# Altium project 2m_DBoard_TX.PrjPcb (part 2 of 2)

## Sheet Digital.SchDoc: {Наименование}
size 420 x 297 mm; DocumentNumber: ПЛАС.ХХХХХХ.ХХХ ХХ; SheetNumber: {}; SheetTotal: {}; PageSetup: Record=PageOptions|CenterHorizontal=False|CenterVertical=False|PrintScale=0.95|XCorrection=0.00|YCorrection=0.00|PrintKind=1|BorderSize=5000000|LeftOffset=0|BottomOffset=0|Orientation=1|PaperLength=1000|PaperWidth=1000|Scale=100|PaperSource=15|PrintQuality=600|MediaType=1|DitherType=10|PaperKind=A4|PrintScaleMode=1; Rule: PcbType=ProtelPcb
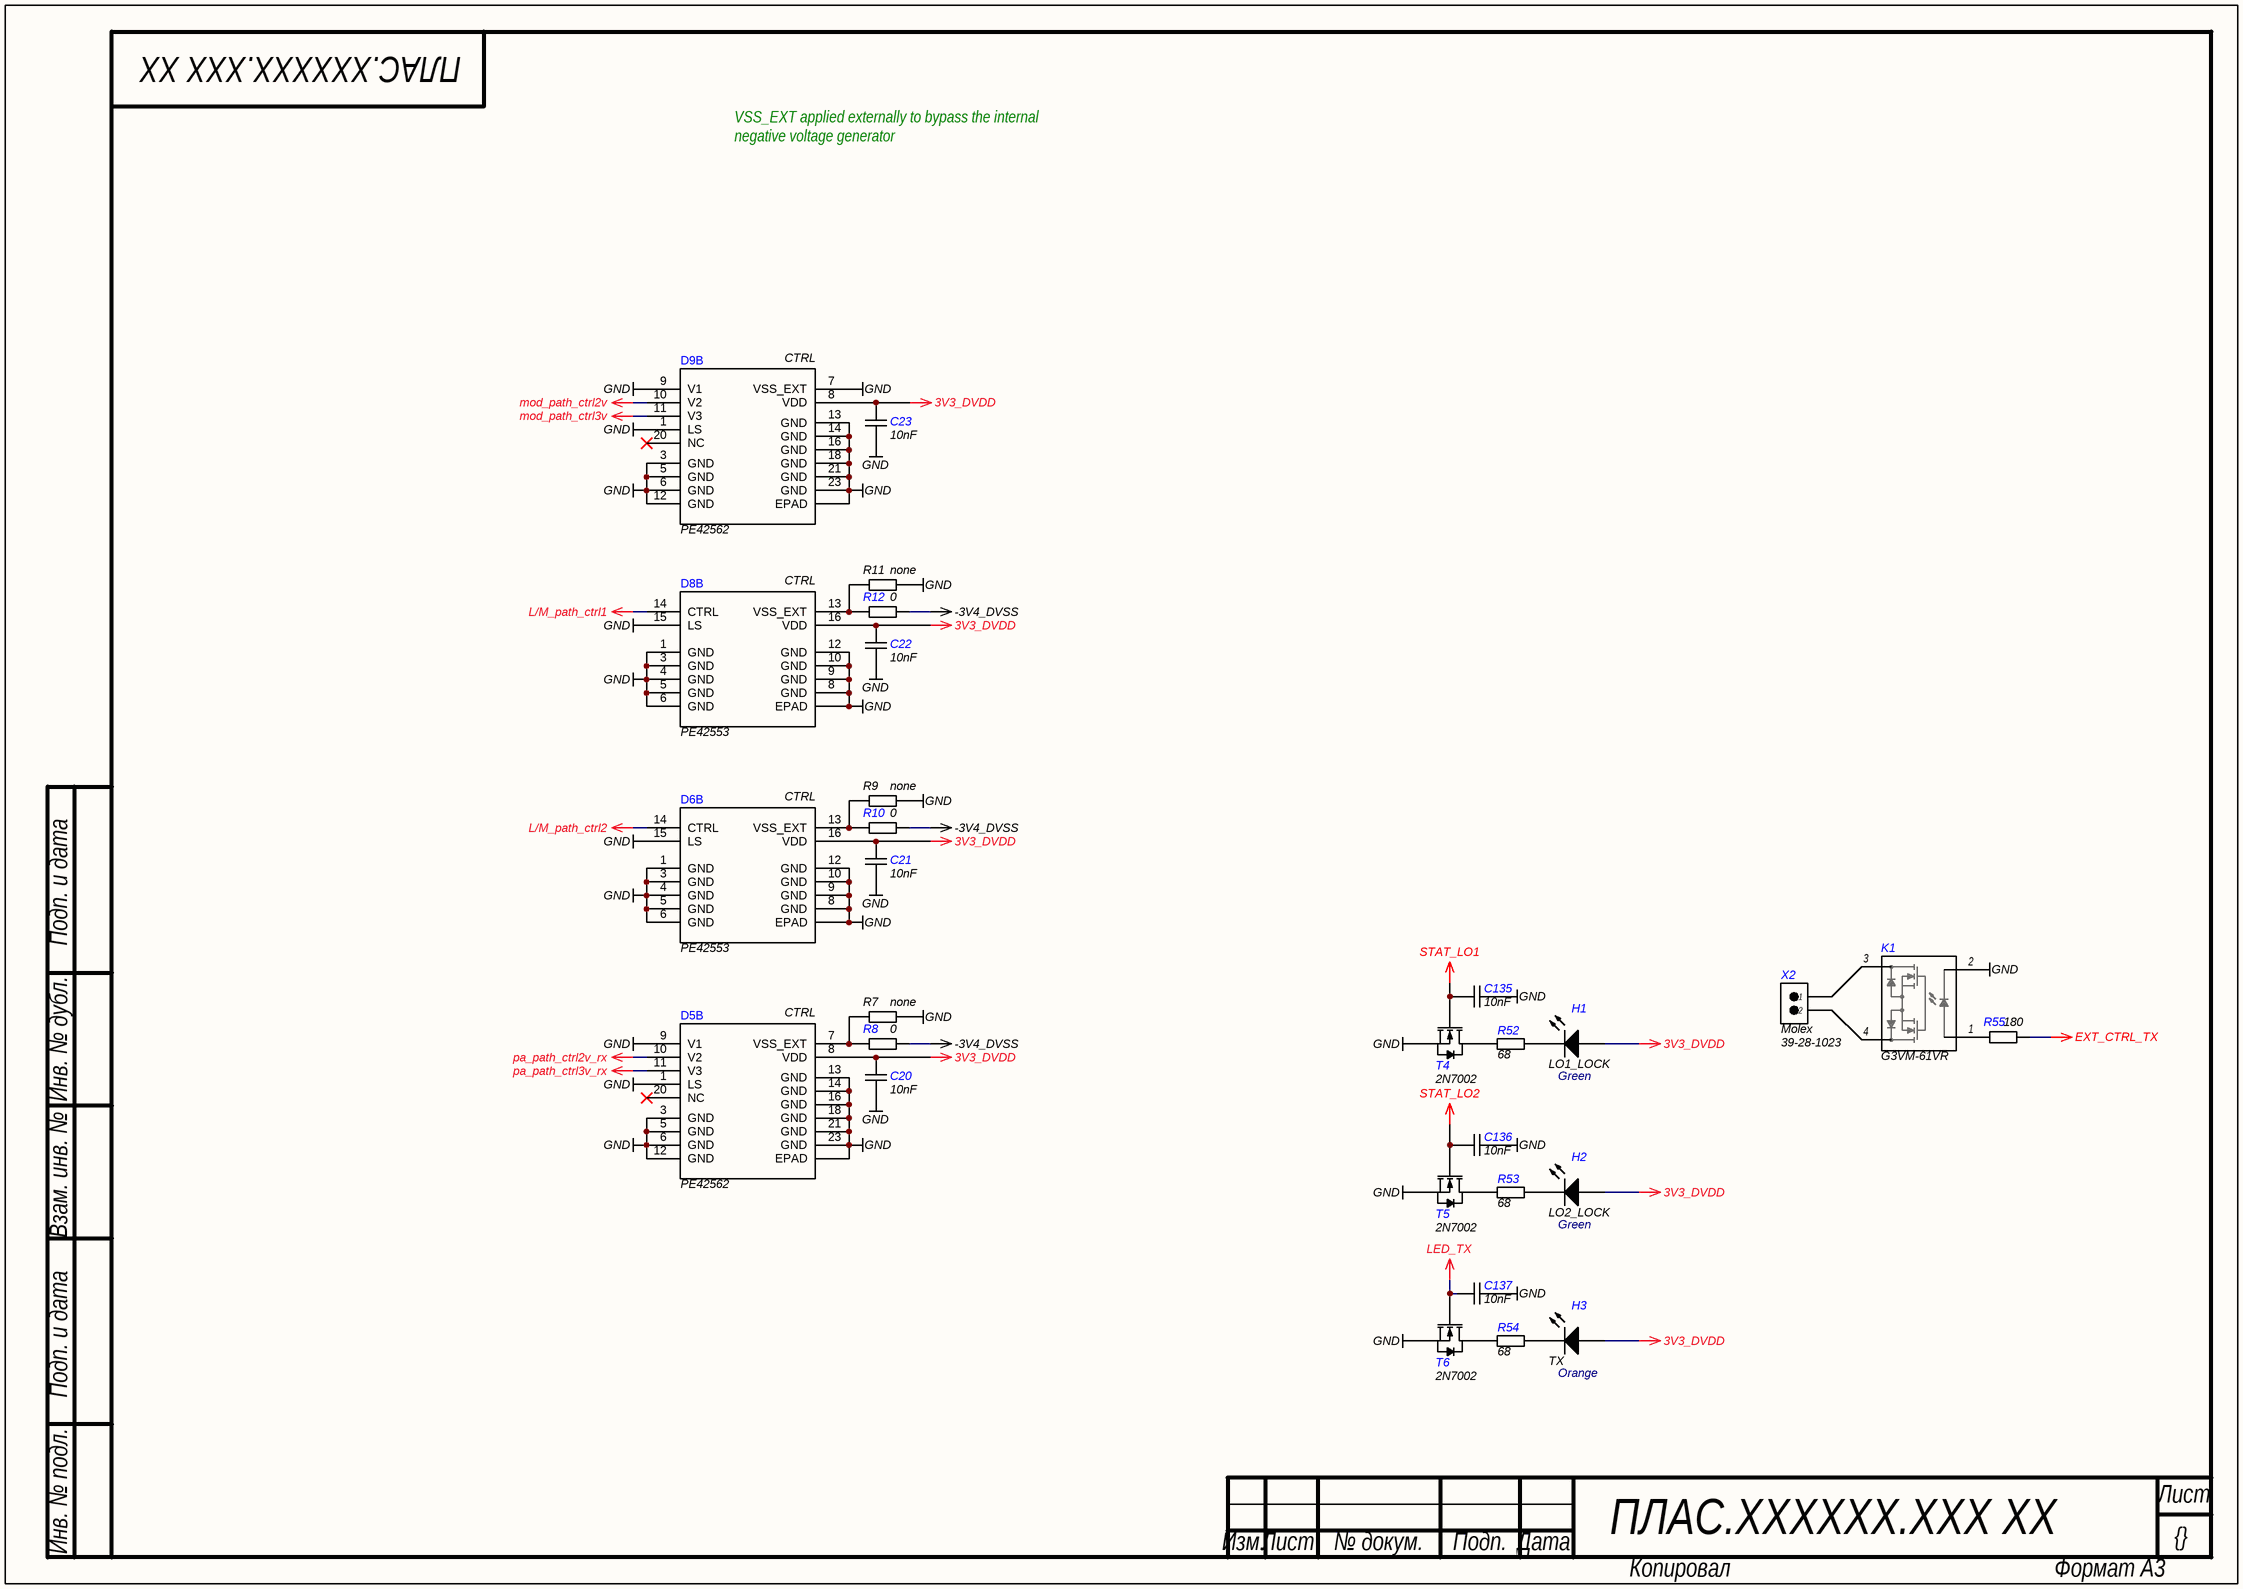
[diagram p5: Digital.SchDoc]

### Parts
C20  value 10nF  [C0402]  (hidden comment: CAP)
C21  value 10nF  [C0402]  (hidden comment: CAP)
C22  value 10nF  [C0402]  (hidden comment: CAP)
C23  value 10nF  [C0402]  (hidden comment: CAP)
C135  value 10nF  [C0402]  (hidden comment: CAP)
C136  value 10nF  [C0402]  (hidden comment: CAP)
C137  value 10nF  [C0402]  (hidden comment: CAP)
D5  PE42562  [QFN-24]  (part B of 2)
D6  PE42553  [QFN-16]  (part B of 2)
D8  PE42553  [QFN-16]  (part B of 2)
D9  PE42562  [QFN-24]  (part B of 2)
H1  LO1_LOCK  Color: Green  [LED_0805_Green]
H2  LO2_LOCK  Color: Green  [LED_0805_Green]
H3  TX  Color: Orange  [LED_0805_Green]
K1  G3VM-61VR  [G3VM-61]
R7  value none  [R0603]  (hidden comment: RES)
R8  value 0  [R0603]  (hidden comment: RES)
R9  value none  [R0603]  (hidden comment: RES)
R10  value 0  [R0603]  (hidden comment: RES)
R11  value none  [R0603]  (hidden comment: RES)
R12  value 0  [R0603]  (hidden comment: RES)
R52  value 68  [R0402]  (hidden comment: RES)
R53  value 68  [R0402]  (hidden comment: RES)
R54  value 68  [R0402]  (hidden comment: RES)
R55  value 180  [R0402]  (hidden comment: RES)
T4  2N7002  [SOT-23]
T5  2N7002  [SOT-23]
T6  2N7002  [SOT-23]
X2  Manufacturer: Molex  P/N: 39-28-1023  [Mini-Fit Jr. Vertical Header]  (hidden comment: Mini-Fit Jr. Vertical Header)

### Nets
3V3_DVDD: C20.1 C21.1 C22.1 C23.1 D5.8(VDD) D6.16(VDD) D8.16(VDD) D9.8(VDD) H1.2(A) H2.2(A) H3.2(A)
-3V4_DVSS: R8.1 R10.1 R12.1
EXT_CTRL_TX: R55.2
GND: C20.2 C21.2 C22.2 C23.2 C135.2 C136.2 C137.2 D5.1(LS) D5.3(GND) D5.5(GND) D5.6(GND) D5.9(V1) D5.12(GND) D5.13(GND) D5.14(GND) D5.16(GND) D5.18(GND) D5.21(GND) D5.23(GND) D5.25(EPAD) D6.1(GND) D6.3(GND) D6.4(GND) D6.5(GND) D6.6(GND) D6.8(GND) D6.9(GND) D6.10(GND) D6.12(GND) D6.15(LS) D6.17(EPAD) D8.1(GND) D8.3(GND) D8.4(GND) D8.5(GND) D8.6(GND) D8.8(GND) D8.9(GND) D8.10(GND) D8.12(GND) D8.15(LS) D8.17(EPAD) D9.1(LS) D9.3(GND) D9.5(GND) D9.6(GND) D9.7(VSS_EXT) D9.9(V1) D9.12(GND) D9.13(GND) D9.14(GND) D9.16(GND) D9.18(GND) D9.21(GND) D9.23(GND) D9.25(EPAD) K1.2 R7.2 R9.2 R11.2 T4.2(S) T5.2(S) T6.2(S)
L/M_path_ctrl1: D8.14(CTRL)
L/M_path_ctrl2: D6.14(CTRL)
LED_TX: C137.1 T6.1(G)
mod_path_ctrl2v: D9.10(V2)
mod_path_ctrl3v: D9.11(V3)
pa_path_ctrl2v_rx: D5.10(V2)
pa_path_ctrl3v_rx: D5.11(V3)
STAT_LO1: C135.1 T4.1(G)
STAT_LO2: C136.1 T5.1(G)
NetD5_7: D5.7(VSS_EXT) R7.1 R8.2
NetD6_13: D6.13(VSS_EXT) R9.1 R10.2
NetD8_13: D8.13(VSS_EXT) R11.1 R12.2
NetH1_1: H1.1(K) R52.2
NetH2_1: H2.1(K) R53.2
NetH3_1: H3.1(K) R54.2
NetK1_1: K1.1 R55.1
NetK1_3: K1.3 X2.1
NetK1_4: K1.4 X2.2
NetR52_1: R52.1 T4.3(D)
NetR53_1: R53.1 T5.3(D)
NetR54_1: R54.1 T6.3(D)

Not connected (* = marked no-connect by the designer): D5 20(NC)*; D9 20(NC)*

### Notes on the sheet
- VSS_EXT applied externally to bypass the internal
  negative voltage generator
- Подп. и дата
- Инв. № дубл.
- Взам. инв. №
- Инв. № подл.
- Лист
- Изм.
- № докум.
- Подп.
- Дата
- Копировал
- Формат А3
- (in symbol PE42562, part B) CTRL

### Library data of the parts
C20-C23 C135-C137 = CAP: SMD Capacitor; Manufacturer: Murata; Material: X7R; Tolerance: 10%; Voltage: 25V; Type: Ceramic Capacitor; P/N: GRM155R71E103KA01D; Supplier 1: Digi-key; Supplier Part Number 1: 490-1312-1-ND; Supplier 2: Mouser; Supplier Part Number 2: 81-GRM36X103K25; Supplier 3: Farnell; Supplier Part Number 3: *
D5 D9 = PE42562: The PE42582 is a HaRP™ technology-enhanced absorptive SP6T RF switch; Manufacturer: Peregrine Technical Solutions; P/N: PE42562A-X; Name: PE42562; Package: 24-lead 4 × 4 × 0.85 mm QFN; Type: Absorptive SP6T RF switch; Supplier 1: Digi-key; Supplier Part Number 1: *; Supplier 2: Mouser; Supplier Part Number 2: 81-PE42562A-X; Supplier 3: Farnell; Supplier Part Number 3: *
D6 D8 = PE42553: HaRPTM technology-enhanced absorptive SPDT; Manufacturer: Peregrine Technical Solutions; P/N: PE42553A-Z; Type: SPDT RF Switch; Name: PE42553; Package: 16-lead 3 × 3 mm QFN; Supplier 1: Digi-Key; Supplier Part Number 1: 1046-1137-1-ND; Supplier 2: Mouser; Supplier Part Number 2: 81-PE42553B-Z; Supplier 3: Farnell; Supplier Part Number 3: *
H1 H2 = LED: CHIP LED LAMP; Manufacturer: Kingbright; Name: APHCM2012; P/N: APHCM2012CGCK-F01; Package: 2.0 x 1.25 mm SMD; Type: CHIP LED LAMP; Supplier 1: Digi-Key; Supplier Part Number 1: 754-1094-1-ND; Supplier 2: Mouser; Supplier Part Number 2: 604-APHCM2012CGCK; Supplier 3: Farnell; Supplier Part Number 3: *
H3 = LED: CHIP LED LAMP; Manufacturer: Kingbright; Name: APHCM2012; P/N: APHCM2012SECK-F01; Package: 2.0 x 1.25 mm SMD; Type: CHIP LED LAMP; Supplier 1: Digi-key; Supplier Part Number 1: 754-1096-1-ND; Supplier 2: Mouser; Supplier Part Number 2: 604-APHCM2012SECK; Supplier 3: Farnell; Supplier Part Number 3: *
K1 = G3VM-61GR1: MOS FET Relay; Manufacturer: Omron; Channel Resistance: 250 mOhm; Current: 1.4A; Voltage: 60V; Name: G3VM-61VR; Package: SOT-23F; P/N: G3VM-61VR; Supplier 1: Digi-Key; Supplier Part Number 1: Z10319CT-ND; Supplier 2: Mouser; Supplier Part Number 2: 653-G3VM-61VRTR05; Supplier 3: Farnell; Supplier Part Number 3: *
R7-R12 = RES: SMD Resistor; Name: Chip SMD Resistor; Power: 0.1 Wt; Tolerance: 1%; P/N: ERJ-3GEY0R00V; Temperature Range: -55…155°C; Supplier 1: Digi-key; Supplier Part Number 1: P0.0GCT-ND; Supplier 2: Mouser; Supplier Part Number 2: 667-ERJ-3GEY0R00V; Supplier 3: Farnell; Supplier Part Number 3: *
R52-R54 = RES: SMD Resistor; Name: Chip SMD Resistor; Power: 0.062 Wt; Tolerance: 5%; P/N: ERJ-2GEJ680X; Temperature Range: -55…155°C; Supplier 1: Digi-key; Supplier Part Number 1: P68JCT-ND; Supplier 2: Mouser; Supplier Part Number 2: 667-ERJ-2GEJ680X; Supplier 3: Farnell; Supplier Part Number 3: *
R55 = RES: SMD Resistor; Manufacturer: Panasonic Electronic Components; Name: Chip SMD Resistor; Power: 0.063 Wt; Tolerance: 1%; P/N: ERJ-2RKF1800X; Temperature Range: -55…155°C; Supplier 1: Digi-key; Supplier Part Number 1: P180LCT-ND; Supplier 2: Mouser; Supplier Part Number 2: 667-ERJ-2RKF1800X; Supplier 3: Farnell; Supplier Part Number 3: *
T4-T6 = 2N7002: N-Channel MOSFET 2N7002; Channel Resistance: 5Ohm; Current: 300mA; Power Dissipation: 0.83W; Voltage: 60V; Name: 2N7002; Type: SOT-23; Package: SOT-23; Supplier 1: Digi-key; Supplier Part Number 1: 1727-8645-1-ND; Supplier 2: Mouser; Supplier Part Number 2: 771-2N7002/HAMR; Supplier 3: Farnell; Supplier Part Number 3: *
X2 = Mini-Fit Jr. Vertical Header: 4.20mm Pitch, Dual Row, 2 Circuits, without Snap-in Plastic Peg PCB Lock; Mate With Series: 5557; Name: Mini-Fit Jr. Vertical Header; Series: 5566; Type: Mini-Fit Jr. Vertical Header, 4.20mm Pitch, Dual Row, 2 Circuits, without Snap-in Plastic Peg PCB Lock; Mate With P/N: 39-01-2020; Supplier 1: Digi-key; Supplier Part Number 1: WM3800-ND; Supplier 2: Mouser; Supplier Part Number 2: 538-39-28-1023; Supplier 3: Farnell; Supplier Part Number 3: *

## Sheet Power.SchDoc: {Наименование}
size 420 x 297 mm; ApprovedBy: {Утвердил}; CheckedBy: {Проверил}; DrawnBy: {Разраб.}; DocumentNumber: АБВГ 123456.789 00; SheetNumber: {}; SheetTotal: {}; Scale: {Мш.}; PageSetup: Record=PageOptions|CenterHorizontal=False|CenterVertical=False|PrintScale=0.95|XCorrection=0.00|YCorrection=0.00|PrintKind=1|BorderSize=5000000|LeftOffset=0|BottomOffset=0|Orientation=1|PaperLength=1000|PaperWidth=1000|Scale=100|PaperSource=15|PrintQuality=600|MediaType=1|DitherType=10|PaperKind=A4|PrintScaleMode=1; ProcessInspection: {Т.контр.}; Mass: {М.}; NormInspection: {Н.контр.}; Letter1Column: {}; Letter2Column: {}; Letter3Column: {}; DocumentType: {Документ}; Rule: PcbType=ProtelPcb
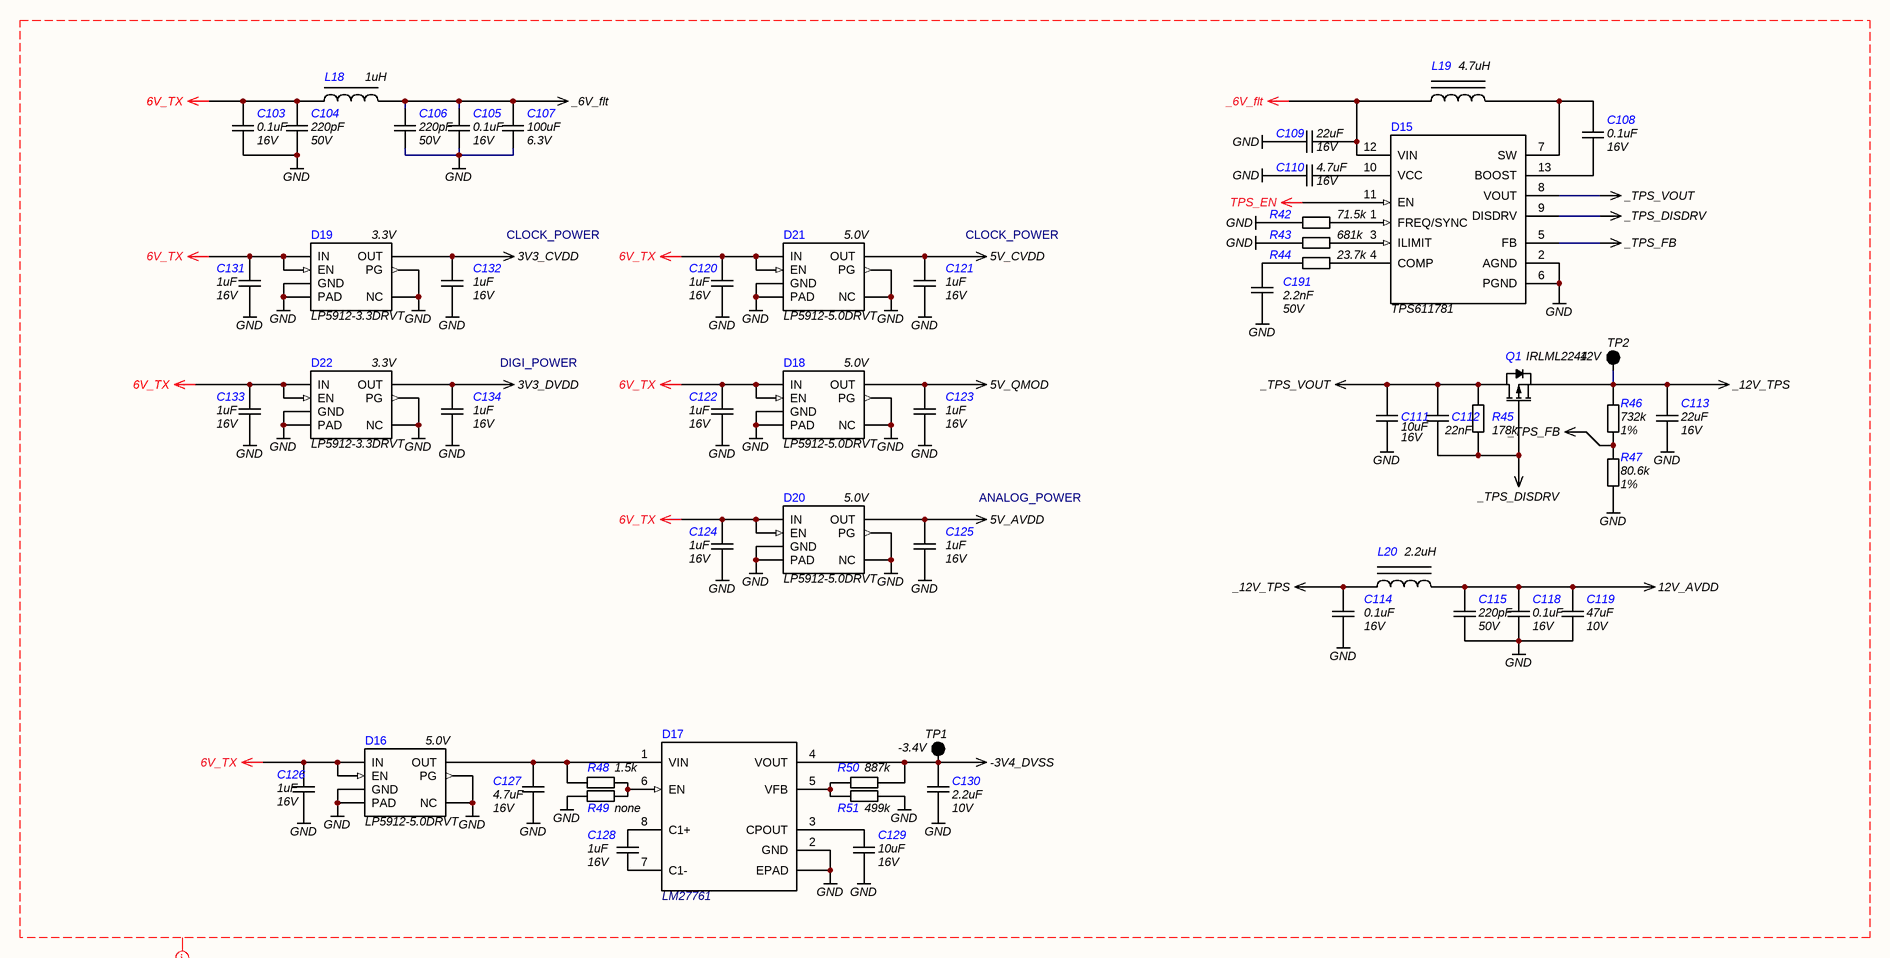
[diagram p6: Power.SchDoc]

### Parts
C103  value 0.1uF  Voltage: 16V  [C0402]  (hidden comment: CAP)
C104  value 220pF  Voltage: 50V  [C0603]  (hidden comment: CAP)
C105  value 0.1uF  Voltage: 16V  [C0402]  (hidden comment: CAP)
C106  value 220pF  Voltage: 50V  [C0603]  (hidden comment: CAP)
C107  value 100uF  Voltage: 6.3V  [C1210]  (hidden comment: CAP uF)
C108  value 0.1uF  Voltage: 16V  [C0402]  (hidden comment: CAP)
C109  value 22uF  Voltage: 16V  [C0805]  (hidden comment: CAP uF)
C110  value 4.7uF  Voltage: 16V  [C0603]  (hidden comment: CAP)
C111  value 10uF  Voltage: 16V  [C0805]  (hidden comment: CAP uF)
C112  value 22nF  [C0402]  (hidden comment: CAP)
C113  value 22uF  Voltage: 16V  [C0805]  (hidden comment: CAP uF)
C114  value 0.1uF  Voltage: 16V  [C0402]  (hidden comment: CAP)
C115  value 220pF  Voltage: 50V  [C0603]  (hidden comment: CAP)
C118  value 0.1uF  Voltage: 16V  [C0402]  (hidden comment: CAP)
C119  value 47uF  Voltage: 10V  [C1210]  (hidden comment: CAP uF)
C120  value 1uF  Voltage: 16V  [C0603]  (hidden comment: CAP)
C121  value 1uF  Voltage: 16V  [C0603]  (hidden comment: CAP)
C122  value 1uF  Voltage: 16V  [C0603]  (hidden comment: CAP)
C123  value 1uF  Voltage: 16V  [C0603]  (hidden comment: CAP)
C124  value 1uF  Voltage: 16V  [C0603]  (hidden comment: CAP)
C125  value 1uF  Voltage: 16V  [C0603]  (hidden comment: CAP)
C126  value 1uF  Voltage: 16V  [C0603]  (hidden comment: CAP)
C127  value 4.7uF  Voltage: 16V  [C0603]  (hidden comment: CAP)
C128  value 1uF  Voltage: 16V  [C0603]  (hidden comment: CAP)
C129  value 10uF  Voltage: 16V  [C0805]  (hidden comment: CAP uF)
C130  value 2.2uF  Voltage: 10V  [C0603]  (hidden comment: CAP)
C131  value 1uF  Voltage: 16V  [C0603]  (hidden comment: CAP)
C132  value 1uF  Voltage: 16V  [C0603]  (hidden comment: CAP)
C133  value 1uF  Voltage: 16V  [C0603]  (hidden comment: CAP)
C134  value 1uF  Voltage: 16V  [C0603]  (hidden comment: CAP)
C191  value 2.2nF  Voltage: 50V  [C0603]  (hidden comment: CAP)
D15  TPS611781  [TPS611781x]
D16  Name: LP5912-5.0DRVT  Voltage: 5.0V  [WSON-6]  (hidden comment: LP5912)
D17  LM27761  [WSON-8]
D18  Name: LP5912-5.0DRVT  Voltage: 5.0V  [WSON-6]  (hidden comment: LP5912)
D19  Name: LP5912-3.3DRVT  Voltage: 3.3V  [WSON-6]  (hidden comment: LP5912)
D20  Name: LP5912-5.0DRVT  Voltage: 5.0V  [WSON-6]  (hidden comment: LP5912)
D21  Name: LP5912-5.0DRVT  Voltage: 5.0V  [WSON-6]  (hidden comment: LP5912)
D22  Name: LP5912-3.3DRVT  Voltage: 3.3V  [WSON-6]  (hidden comment: LP5912)
L18  value 1uH  [L1210_Murata LQH]  (hidden comment: Inductor LF)
L19  value 4.7uH  [XAL4030]  (hidden comment: Inductor PWR)
L20  value 2.2uH  [XAL4020]  (hidden comment: Inductor PWR)
Q1  IRLML2244  [SOT-23]
R42  value 71.5k  [R0402]  (hidden comment: RES)
R43  value 681k  [R0402]  (hidden comment: RES)
R44  value 23.7k  [R0603]  (hidden comment: RES)
R45  value 178k  [R0402]  (hidden comment: RES)
R46  value 732k  Tolerance: 1%  [R0402]  (hidden comment: RES)
R47  value 80.6k  Tolerance: 1%  [R0402]  (hidden comment: RES)
R48  value 1.5k  [R0402]  (hidden comment: RES)
R49  value none  [R0402]  (hidden comment: RES)
R50  value 887k  [R0402]  (hidden comment: RES)
R51  value 499k  [R0402]  (hidden comment: RES)
TP1  -3.4V  [Control Point]
TP2  12V  [Control Point]

### Nets
3V3_CVDD: C132.1 D19.1(OUT)
3V3_DVDD: C134.1 D22.1(OUT)
5V_AVDD: C125.1 D20.1(OUT)
5V_CVDD: C121.1 D21.1(OUT)
5V_QMOD: C123.1 D18.1(OUT)
6V_TX: C103.2 C104.2 C120.1 C122.1 C124.1 C126.1 C131.1 C133.1 D16.4(EN) D16.6(IN) D18.4(EN) D18.6(IN) D19.4(EN) D19.6(IN) D20.4(EN) D20.6(IN) D21.4(EN) D21.6(IN) D22.4(EN) D22.6(IN) L18.1
12V_AVDD: C115.2 C118.2 C119.2 L20.2
-3V4_DVSS: C130.1 D17.4(VOUT) R50.2 TP1.1
_6V_flt: C105.2 C106.2 C107.2 C109.1 D15.12(VIN) L18.2 L19.1
_12V_TPS: C113.2 C114.2 L20.1 Q1.2(S) R46.2 TP2.1
_TPS_DISDRV: C112.2 D15.9(DISDRV) Q1.1(G) R45.1
_TPS_FB: D15.5(FB) R46.1 R47.2
_TPS_VOUT: C111.2 C112.1 D15.8(VOUT) Q1.3(D) R45.2
GND: C103.1 C104.1 C105.1 C106.1 C107.1 C109.2 C110.2 C111.1 C113.1 C114.1 C115.1 C118.1 C119.1 C120.2 C121.2 C122.2 C123.2 C124.2 C125.2 C126.2 C127.2 C129.2 C130.2 C131.2 C132.2 C133.2 C134.2 C191.1 D15.2(AGND) D15.6(PGND) D16.0(PAD) D16.2(NC) D16.3(PG) D16.5(GND) D17.0(EPAD) D17.2(GND) D18.0(PAD) D18.2(NC) D18.3(PG) D18.5(GND) D19.0(PAD) D19.2(NC) D19.3(PG) D19.5(GND) D20.0(PAD) D20.2(NC) D20.3(PG) D20.5(GND) D21.0(PAD) D21.2(NC) D21.3(PG) D21.5(GND) D22.0(PAD) D22.2(NC) D22.3(PG) D22.5(GND) R42.1 R43.1 R47.1 R49.1 R51.2
TPS_EN: D15.11(EN)
NetC108_1: C108.1 D15.13(BOOST)
NetC108_2: C108.2 D15.7(SW) L19.2
NetC110_1: C110.1 D15.10(VCC)
NetC127_1: C127.1 D16.1(OUT) D17.1(VIN) R48.2
NetC128_1: C128.1 D17.7(C1-)
NetC128_2: C128.2 D17.8(C1+)
NetC129_1: C129.1 D17.3(CPOUT)
NetC191_2: C191.2 R44.1
NetD15_1: D15.1(FREQ/SYNC) R42.2
NetD15_3: D15.3(ILIMIT) R43.2
NetD15_4: D15.4(COMP) R44.2
NetD17_5: D17.5(VFB) R50.1 R51.1
NetD17_6: D17.6(EN) R48.1 R49.2

### Layout directives
net class POWER: 3V3_CVDD, 3V3_DVDD, 5V_AVDD, 5V_CVDD, 5V_QMOD, 6V_TX, 12V_AVDD, -3V4_DVSS, _6V_flt, _12V_TPS, _TPS_DISDRV, _TPS_FB, _TPS_VOUT, GND, TPS_EN

### Notes on the sheet
- CLOCK_POWER
- (near C121) CLOCK_POWER
- DIGI_POWER
- ANALOG_POWER
- Перв. примен.
- Справ. №
- Подп. и дата
- Инв. № дубл.
- Взам. инв. №
- Изм.
- Лист
- № докум.
- Подп.
- Дата
- Лит.
- Масса
- Масштаб
- Т.контр.
- Пров.
- Разраб.
- Листов
- Инв. № подл.
- Н.контр.
- Утв.
- Копировал
- Формат А3

### Library data of the parts
C103 C105 C108 C114 C118 = CAP: SMD Capacitor; Manufacturer: Murata; Material: X7R; Tolerance: 10%; Type: Ceramic Capacitor; P/N: GRM155R71C104KA88J; Supplier 1: Digi-key; Supplier Part Number 1: 490-6328-1-ND; Supplier 2: Mouser; Supplier Part Number 2: 81-GRM155R71C104KA8J; Supplier 3: Farnell; Supplier Part Number 3: *
  C103 C105 C118: Parameter 1: *
C104 C106 C115 = CAP: SMD Capacitor; Manufacturer: Kemet; Material: X7R; Tolerance: 10%; Type: Ceramic Capacitor; P/N: C0603C221K5RACAUTO; Supplier 1: Digi-key; Supplier Part Number 1: 399-6869-1-ND; Supplier 2: Mouser; Supplier Part Number 2: 80-C0603C221K5RAUTO; Supplier 3: Farnell; Supplier Part Number 3: *
C107 = CAP uF: SMD Capacitor; Manufacturer: Murata; Material: X5R; Tolerance: 20%; Type: Ceramic Capacitor; P/N: GRM32ER60J107ME20L; Supplier 1: Digi-key; Supplier Part Number 1: 490-3390-1-ND; Supplier 2: Mouser; Supplier Part Number 2: 81-GRM32ER60J107ME20; Supplier 3: Farnell; Supplier Part Number 3: *
C109 C113 = CAP uF: SMD Capacitor; Manufacturer: Murata; Material: X5R; Tolerance: ±20%; Type: Ceramic Capacitor; P/N: GRM21BR61C226ME44L; Supplier 1: Digi-key; Supplier Part Number 1: 490-10747-1-ND; Supplier 2: Mouser; Supplier Part Number 2: 81-GRM21BR61C226ME4L; Supplier 3: Farnell; Supplier Part Number 3: *
C110 C127 = CAP: SMD Capacitor; Manufacturer: Samsung; Material: X5R; Tolerance: 10%; Type: Ceramic Capacitor; P/N: CL10A475KO8NNNC; Supplier 1: Digi-key; Supplier Part Number 1: 1276-1784-1-ND; Supplier 2: Mouser; Supplier Part Number 2: 187-CL10A475KO8NNNC; Supplier 3: Farnell; Supplier Part Number 3: 3013397
C111 C129 = CAP uF: SMD Capacitor; Manufacturer: Murata; Material: X5R; Tolerance: ±10%; Type: Ceramic Capacitor; P/N: GRM21BR61C106KE15K; Supplier 1: Digi-key; Supplier Part Number 1: 490-6473-1-ND; Supplier 2: Mouser; Supplier Part Number 2: 81-GRM21BR61C106KE5K; Supplier 3: Farnell; Supplier Part Number 3: *
C112 = CAP: SMD Capacitor; Manufacturer: Murata; Material: X7R; Tolerance: 10%; Voltage: 50V; Type: Ceramic Capacitor; P/N: GCM155R71H223KA55D; Supplier 1: Digi-key; Supplier Part Number 1: 490-4763-1-ND; Supplier 2: Mouser; Supplier Part Number 2: 81-GCM155R71H223KA5D; Supplier 3: Farnell; Supplier Part Number 3: *
C119 = CAP uF: SMD Capacitor; Manufacturer: Murata; Material: X7R; Tolerance: 10%; Type: Ceramic Capacitor; P/N: GRM32ER71A476KE15L; Supplier 1: Digi-key; Supplier Part Number 1: 490-5312-1-ND; Supplier 2: Mouser; Supplier Part Number 2: 81-GRM32ER71A476KE5L; Supplier 3: Farnell; Supplier Part Number 3: *
C120-C126 C128 C131-C134 = CAP: SMD Capacitor; Manufacturer: Kemet; Material: X7R; Tolerance: 10%; Type: Ceramic Capacitor; P/N: C0603C105K4RACTU; Supplier 1: Digi-key; Supplier Part Number 1: 399-C0603C105K4RAC7867CT-ND; Supplier 2: Mouser; Supplier Part Number 2: 80-C0603C105K4R; Supplier 3: Farnell; Supplier Part Number 3: *
C130 = CAP: SMD Capacitor; Manufacturer: Murata; Material: X7R; Tolerance: 10%; Type: Ceramic Capacitor; P/N: GRM188R71A225KE15J; Supplier 1: Digi-key; Supplier Part Number 1: 490-6418-1-ND; Supplier 2: Mouser; Supplier Part Number 2: 81-GRM188R71A225KE5J; Supplier 3: Farnell; Supplier Part Number 3: *
C191 = CAP: SMD Capacitor; Manufacturer: Murata; Material: NP0; Tolerance: ±5%; Type: Ceramic Capacitor; P/N: GRM1885C1H222JA01D; Supplier 1: Digi-key; Supplier Part Number 1: 490-1459-1-ND; Supplier 2: Mouser; Supplier Part Number 2: 81-GRM1885C1H222JA01; Supplier 3: Farnell; Supplier Part Number 3: *
D15 = TPS611781: 10-A Fully-Integrated Synchronous Boost with Load Disconnect Control; Manufacturer: Texas Instruments; Voltage: 4.5 V to 20 V; P/N: TPS611781RNW; Current: 10 A; Name: TPS611781; Package: 13-VQFN-HR (3.5x3.0); Temperature Range: –40°C to 125°C; Type: Synchronous Boost; Supplier 1: Digi-Key; Supplier Part Number 1: 296-48313-1-ND; Supplier 2: Mouser; Supplier Part Number 2: 595-TPS611781RNWR; Supplier 3: Farnell; Supplier Part Number 3: *
D16 D18-D22 = LP5912: LP5912 500-mA Low-Noise, Low-IQ LDO; Manufacturer: Texas Instruments; Type: Low-Noise LDO; Current: 500mA; Package: WSON; Temperature Range: –40°C to 125°C; Supplier 1: Digi-Key; Supplier 2: Mouser; Supplier 3: Farnell; Supplier Part Number 3: *
  D16 D18 D20 D21: P/N: LP5912-5.0DRVT; Supplier Part Number 1: 296-52224-1-ND; Supplier Part Number 2: 595-LP5912-5.0DRVT
  D19 D22: P/N: LP5912-3.3DRVT; Supplier Part Number 1: 296-44153-2-ND; Supplier Part Number 2: 595-LP5912-3.3DRVT
D17 = LM27761: Low-Noise, Regulated, Switched-Capacitor Voltage Inverter; Manufacturer: Texas Instruments; Voltage: 2.7 V to 5.5; P/N: LM27761DSGT; Current: 250 mA; Name: LM27761; Package: WSON; Temperature Range: –40°C to 125°C; Type: Voltage Inverter; Supplier 1: Digi-key; Supplier Part Number 1: 296-43882-1-ND; Supplier 2: Mouser; Supplier Part Number 2: 595-LM27761DSGT; Supplier 3: Farnell; Supplier Part Number 3: *
L18 = Inductor LF: Inductor Power Lines; Manufacturer: Murata; Name: LQH32PN1R0NNC; Current: 2500mA; Tolerance: 5%; Frequency: 100MHz; Temperature Range: -25ºC to 85ºC; Series: LQH; P/N: LQH32PN1R0NNC; Supplier 1: Digi-key; Supplier Part Number 1: 490-12035-1-ND; Supplier 2: Mouser; Supplier Part Number 2: 81-LQH32PN1R0NNCL; Supplier 3: Farnell; Supplier Part Number 3: *
L19 = Inductor PWR: Magnetic-Core Inductor; Manufacturer: Coilcraft; Name: XEL4030-472MEB; Current: 5A; Tolerance: ±30%; Temperature Range: -40ºC to 125ºC; Supplier 1: Digi-key; Supplier Part Number 1: *; Supplier 2: Mouser; Supplier Part Number 2: 994-XEL4030-472MEC; Supplier 3: Farnell; Supplier Part Number 3: 2836831
L20 = Inductor PWR: Magnetic-Core Inductor; Manufacturer: Coilcraft; Name: XEL4020-222MEC; Current: 5.9A; Tolerance: ±30%; Temperature Range: -40ºC to 125ºC; P/N: XEL4020-222MEC; Supplier 2: Mouser; Supplier Part Number 2: 994-XEL4020-222MEC; Supplier 3: Farnell; Supplier Part Number 3: 2836818; Supplier 1: Digi-key; Supplier Part Number 1: *
Q1 = IRLML2244: P-Channel MOSFET; Current: 4.3A; Channel Resistance: 54 mΩ; Power Dissipation: 1.3W; Voltage: -20V; P/N: IRLML2244TRPBF; Name: IRLML2244; Package: SOT-23; Type: P-Channel Mosfet; Value: IRLML2244; Supplier 1: Digi-key; Supplier Part Number 1: IRLML2244TRPBFCT-ND; Supplier 2: Mouser; Supplier Part Number 2: 942-IRLML2244TRPBF; Supplier 3: Farnell; Supplier Part Number 3: *
R42 = RES: SMD Resistor; Manufacturer: Panasonic Electronic Components; Name: Chip SMD Resistor; Power: 0.063 Wt; Tolerance: 1%; P/N: ERJ-2RKF7152X; Temperature Range: -55…155°C; Supplier 1: Digi-key; Supplier Part Number 1: P71.5KLCT-ND; Supplier 2: Mouser; Supplier Part Number 2: 667-ERJ-2RKF7152X; Supplier 3: Farnell; Supplier Part Number 3: *
R43 = RES: SMD Resistor; Manufacturer: Panasonic Electronic Components; Name: Chip SMD Resistor; Power: 0.063 Wt; Tolerance: 1%; P/N: ERJ-2RKF6813X; Temperature Range: -55…155°C; Supplier 1: Digi-key; Supplier Part Number 1: P681KLCT-ND; Supplier 2: Mouser; Supplier Part Number 2: 667-ERJ-2RKF6813X; Supplier 3: Farnell; Supplier Part Number 3: *
R44 = RES: SMD Resistor; Manufacturer: Panasonic Electronic Components; Name: Chip SMD Resistor; Power: 0.1 Wt; Tolerance: 1%; P/N: ERJ-3EKF2372V; Temperature Range: -55…155°C; Supplier 1: Digi-key; Supplier Part Number 1: P23.7KHCT-ND; Supplier 2: Mouser; Supplier Part Number 2: 667-ERJ-3EKF2372V; Supplier 3: Farnell; Supplier Part Number 3: *
R45 = RES: SMD Resistor; Manufacturer: Panasonic Electronic Components; Name: Chip SMD Resistor; Power: 0.063 Wt; Tolerance: 1%; P/N: ERJ-2RKF1783X; Temperature Range: -55…155°C; Supplier 1: Digi-key; Supplier Part Number 1: P178KLCT-ND; Supplier 2: Mouser; Supplier Part Number 2: 667-ERJ-2RKF1783X; Supplier 3: Farnell; Supplier Part Number 3: *
R46 = RES: SMD Resistor; Manufacturer: Panasonic Electronic Components; Name: Chip SMD Resistor; Power: 0.063 Wt; P/N: ERJ-2RKF7323X; Temperature Range: -55…155°C; Supplier 1: Digi-key; Supplier Part Number 1: P732KLCT-ND; Supplier 2: Mouser; Supplier Part Number 2: 667-ERJ-2RKF7323X; Supplier 3: Farnell; Supplier Part Number 3: *
R47 = RES: SMD Resistor; Manufacturer: Panasonic Electronic Components; Name: Chip SMD Resistor; Power: 0.063 Wt; P/N: ERJ-2RKF8062X; Temperature Range: -55…155°C; Supplier 1: Digi-key; Supplier Part Number 1: P80.6KLCT-ND; Supplier 2: Mouser; Supplier Part Number 2: 667-ERJ-2RKF8062X; Supplier 3: Farnell; Supplier Part Number 3: *
R48 = RES: SMD Resistor; Manufacturer: Panasonic Electronic Components; Name: Chip SMD Resistor; Power: 0.063 Wt; Tolerance: 0.5%; P/N: ERJ-2RHD1501X; Temperature Range: -55…155°C; Supplier 1: Digi-key; 1: *; Supplier 2: Mouser; Supplier Part Number 2: 667-ERJ-2RHD1501X; Supplier 3: Farnell; Supplier Part Number 3: 2379819
R49 = RES: SMD Resistor; Name: Chip SMD Resistor; Power: 0.1 Wt; Tolerance: 1%; P/N: ERJ-2GE0R00X; Temperature Range: -55…155°C; Supplier 4: Digi-key; Supplier Part Number 4: P0.0JCT-ND; Supplier 5: Mouser; Supplier Part Number 5: 667-ERJ-2GE0R00X; Supplier 6: Farnell; Supplier Part Number 6: *
R50 = RES: SMD Resistor; Manufacturer: Panasonic Electronic Components; Name: Chip SMD Resistor; Power: 0.1 Wt; Tolerance: ±1%; P/N: ERJ-2RKF8873X; Temperature Range: -55…155°C; Supplier 1: Digi-key; Supplier Part Number 1: P887KLCT-ND; Supplier 2: Mouser; Supplier Part Number 2: 667-ERJ-2RKF8873X; Supplier 3: Farnell; Supplier Part Number 3: *
R51 = RES: SMD Resistor; Manufacturer: Panasonic Electronic Components; Name: Chip SMD Resistor; Power: 0.1 Wt; Tolerance: ±1%; P/N: ERJ-2RKF4993X; Temperature Range: -55…155°C; Supplier 1: Digi-key; Supplier Part Number 1: P499KLCT-ND; Supplier 2: Mouser; Supplier Part Number 2: 667-ERJ-2RKF4993X; Supplier 3: Farnell; Supplier Part Number 3: *
TP1 TP2 = Test  Point: Supplier 4: Digi-key; Supplier Part Number 4: *; Supplier 5: Mouser; Supplier Part Number 5: *; Supplier 6: Farnell; Supplier Part Number 6: *

## Nets that join several sheets
3V3_CVDD: IF_TX (7 pins), REFCLK (8 pins), Power (C132.1 D19.1)
3V3_DVDD: CPLD (41 pins), TX (C16.2 D3.2 R5.1), REFCLK (5 pins), Digital (11 pins), Power (C134.1 D22.1)
5V_AVDD: TX (C13.2 C18.2 L4.1 L6.1), Power (C125.1 D20.1)
5V_CVDD: IF_TX (C46.2 C47.2 C48.1 L15.2), REFCLK (6 pins), Power (C121.1 D21.1)
5V_QMOD: IF_TX (6 pins), Power (C123.1 D18.1)
6V_TX: DBoard_conn (X1.4 X1.6), Power (21 pins)
12V_AVDD: TX (C3.2 C4.2 L2.1), Power (C115.2 C118.2 C119.2 L20.2)
-3V4_DVSS: Digital (R8.1 R10.1 R12.1), Power (C130.1 D17.4 R50.2 TP1.1)
cpld_io_00: CPLD (R40.2), DBoard_conn (X1.35)
cpld_io_01: CPLD (R36.7), DBoard_conn (X1.33)
cpld_io_02: CPLD (R36.6), DBoard_conn (X1.31)
cpld_io_03: CPLD (R36.5), DBoard_conn (X1.29)
cpld_io_04: CPLD (R35.8), DBoard_conn (X1.27)
cpld_io_05: CPLD (R35.7), DBoard_conn (X1.25)
cpld_io_06: CPLD (R35.6), DBoard_conn (X1.23)
cpld_io_07: CPLD (R35.5), DBoard_conn (X1.21)
cpld_io_08: CPLD (R34.8), DBoard_conn (X1.19)
cpld_io_09: CPLD (R34.7), DBoard_conn (X1.17)
cpld_io_10: CPLD (R34.6), DBoard_conn (X1.15)
cpld_io_11: CPLD (R34.5), DBoard_conn (X1.13)
cpld_io_12: CPLD (R33.8), DBoard_conn (X1.11)
cpld_io_13: CPLD (R33.7), DBoard_conn (X1.9)
cpld_io_14: CPLD (R33.6), DBoard_conn (X1.7)
cpld_io_15: CPLD (R33.5), DBoard_conn (X1.5)
CS_LO1: CPLD (R30.5), REFCLK (D12.3)
CS_LO2: CPLD (R31.5), REFCLK (D13.3)
EXT_CTRL_TX: CPLD (D14.K1), Digital (R55.2)
GND: CPLD (47 pins), DBoard_conn (23 pins), IF_TX (64 pins), TX (96 pins), REFCLK (28 pins), Digital (63 pins), Power (61 pins)
HFreq_TX: IF_TX (D9.2), TX (D5.2)
HFreq_UpMxd_TX: IF_TX (D8.11), TX (Z2.IN)
L/M_path_ctrl1: CPLD (D14.B6), Digital (D8.14)
L/M_path_ctrl2: CPLD (D14.A6), Digital (D6.14)
LE_ATT: CPLD (R37.6), TX (D3.16)
LED_TX: CPLD (D14.L1), Digital (C137.1 T6.1)
LFreq_DownMxd_TX: IF_TX (D6.2), TX (Z1.IN)
MISO_LO1: CPLD (R30.8), REFCLK (D12.6)
MISO_LO2: CPLD (R31.8), REFCLK (D13.6)
MISO_TX: CPLD (R32.6), DBoard_conn (X1.32)
mod_path_ctrl2v: CPLD (D14.B7), Digital (D9.10)
mod_path_ctrl3v: CPLD (D14.A7), Digital (D9.11)
MOSI_ATT: CPLD (R37.8), TX (D3.18)
MOSI_LO1: CPLD (R30.7), REFCLK (D12.5)
MOSI_LO2: CPLD (R31.7), REFCLK (D13.5)
MOSI_TX: CPLD (R32.7), DBoard_conn (X1.34)
MUTE_LO1: CPLD (D14.P14), REFCLK (D12.9)
pa_path_ctrl2v_rx: CPLD (D14.A5), Digital (D5.10)
pa_path_ctrl3v_rx: CPLD (D14.B5), Digital (D5.11)
QMOD_DSOP: CPLD (D14.A14), IF_TX (D10.1)
ref_freq_tx_n: DBoard_conn (X1.14), IF_TX (C43.2)
ref_freq_tx_p: DBoard_conn (X1.12), IF_TX (C44.2)
SCLK_ATT: CPLD (R37.7), TX (D3.17)
SCLK_LO1: CPLD (R30.6), REFCLK (D12.4)
SCLK_LO2: CPLD (R31.6), REFCLK (D13.4)
SCLK_TX: CPLD (R32.5), DBoard_conn (X1.30)
SEN_TX: CPLD (R32.8), DBoard_conn (X1.36)
STAT_LO1: CPLD (D14.N14), REFCLK (D12.2), Digital (C135.1 T4.1)
STAT_LO2: CPLD (D14.M14), REFCLK (D13.2), Digital (C136.1 T5.1)
TPS_EN: CPLD (D14.M1), Power (D15.11)
TX_IOUTA_N: DBoard_conn (X1.61), IF_TX (C40.2 L14.1 R20.2)
TX_IOUTA_P: DBoard_conn (X1.59), IF_TX (C40.1 L13.1 R19.1)
TX_IOUTB_N: DBoard_conn (X1.51), IF_TX (C34.2 L10.1 R17.2)
TX_IOUTB_P: DBoard_conn (X1.49), IF_TX (C34.1 L9.1 R16.1)